# Altium schematic sheet TopSheet_Classes.SchDoc: CLASSES
size 431 x 279 mm; Organization: ORGANIZATION; Address1: ADDRESS 1; Address2: ADDRESS 2; Address3: ADDRESS 3; Address4: ADDRESS 3; Revision: A; SheetNumber: 1; SheetTotal: 2
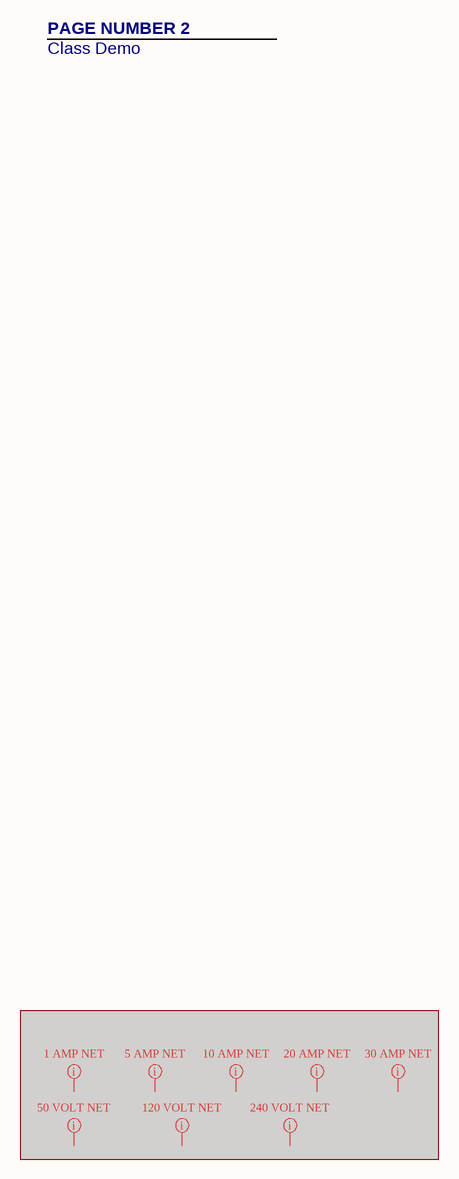
[diagram p0: TopSheet_Classes.SchDoc]

## Layout directives
net class AMP_1: (no net found under the mark)
net class AMP_10: (no net found under the mark)
net class AMP_20: (no net found under the mark)
net class AMP_30: (no net found under the mark)
net class VOLT_120: (no net found under the mark)
net class VOLT_240: (no net found under the mark)
net class VOLT_50: (no net found under the mark)
net class AMP_5: (no net found under the mark)

## Notes on the sheet
- PAGE NUMBER 2
- Class Demo
- 8
- 7
- 6
- 5
- 4
- 3
- DWG. NO.
- REV.
- SHT.
- 2
- 1
- THIS DOCUMENT AND THE DATA DISCLOSED HEREIN OR HEREWITH IS THE PROPERTY OF ALTIUM LIMITED AND MAY BE FREELY DISTRIBUTED IN WHOLE. NO RIGHTS ARE RESERVED OR EXPRESS OR IMPLIED WARANTEE GIVEN.
- REVISION
- DESCRIPTION
- DATE
- APPROVED
- F
- E
- D
- C
- B
- ENG:
- APPROVALS
- PROJECT
- A
- DSN:
- CHK:
- REFERENCE DOCUMENTS
- PROJECT REVISION:
- TITLE
- DOCUMENT REVISION:
- DESIGN ITEM:
- BOM:
- FAB DWG:
- PCB DWG:
- ASSY DWG:
- SCALE:
- SIZE
- CAGE CODE
- FILE NAME
- DWG NO.
- SHEET
- OF
- REV